# Altium schematic sheet relay_pair_lower.SchDoc
size A4
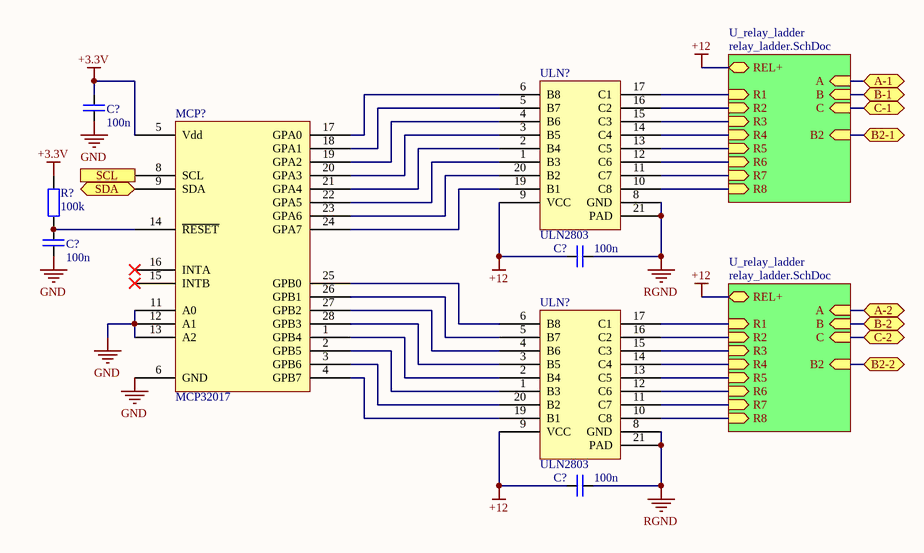
[diagram p0: relay_pair_lower.SchDoc]

## Parts
(Parts that share a designator on the sheet are numbered #1, #2 ... from top to bottom, then left to right.)
C?#1  100n  [R1005_0402i_L]
C?#2  100n  [R1005_0402i_L]
C?#3  100n  [R1005_0402i_L]
C?#4  100n  [R1005_0402i_L]
MCP?  MCP32017  [MCP23017 QFN]
R?  100k  [R1005_0402i_L]
ULN?#1  ULN2803  [QFN127P600-8N]
ULN?#2  ULN2803  [QFN127P600-8N]

## Sub-sheets
U_relay_ladder = relay_ladder.SchDoc: B (in), C (in), A (in), REL+ (bidir), R1 (in), R2 (in), R3 (in), R4 (in), R5 (in), R6 (in), R7 (in), R8 (in), B2 (in)
U_relay_ladder = relay_ladder.SchDoc: B (in), C (in), A (in), REL+ (bidir), R1 (in), R2 (in), R3 (in), R4 (in), R5 (in), R6 (in), R7 (in), R8 (in), B2 (in)

## Ports
A-1 (bidir), A-2 (bidir), B2-1 (bidir), B2-2 (bidir), B-1 (bidir), B-2 (bidir), C-1 (bidir), C-2 (bidir), SCL (in), SDA (bidir)

## Nets
+3.3V: C?#1.2 MCP?.5(Vdd) R?.1
+12: C?#3.1 C?#4.1 ULN?#1.9(VCC) ULN?#2.9(VCC) ; sheet U_relay_ladder/REL+, sheet U_relay_ladder/REL+
GND: C?#1.1 C?#2.1 MCP?.6(GND) MCP?.11(A0) MCP?.12(A1) MCP?.13(A2)
RGND: C?#3.2 C?#4.2 ULN?#1.8(GND) ULN?#1.21(PAD) ULN?#2.8(GND) ULN?#2.21(PAD)
A-1: port A-1, sheet U_relay_ladder/A
A-2: port A-2, sheet U_relay_ladder/A
B2-1: port B2-1, sheet U_relay_ladder/B2
B2-2: port B2-2, sheet U_relay_ladder/B2
B-1: port B-1, sheet U_relay_ladder/B
B-2: port B-2, sheet U_relay_ladder/B
C-1: port C-1, sheet U_relay_ladder/C
C-2: port C-2, sheet U_relay_ladder/C
SCL: MCP?.8(SCL) ; port SCL
SDA: MCP?.9(SDA) ; port SDA
NetC?#2_2: C?#2.2 MCP?.14(~{RESET}) R?.2
NetMCP?_1: MCP?.1(GPB4) ULN?#2.2(B4)
NetMCP?_2: MCP?.2(GPB5) ULN?#2.1(B3)
NetMCP?_3: MCP?.3(GPB6) ULN?#2.20(B2)
NetMCP?_4: MCP?.4(GPB7) ULN?#2.19(B1)
NetMCP?_17: MCP?.17(GPA0) ULN?#1.6(B8)
NetMCP?_18: MCP?.18(GPA1) ULN?#1.5(B7)
NetMCP?_19: MCP?.19(GPA2) ULN?#1.4(B6)
NetMCP?_20: MCP?.20(GPA3) ULN?#1.3(B5)
NetMCP?_21: MCP?.21(GPA4) ULN?#1.2(B4)
NetMCP?_22: MCP?.22(GPA5) ULN?#1.1(B3)
NetMCP?_23: MCP?.23(GPA6) ULN?#1.20(B2)
NetMCP?_24: MCP?.24(GPA7) ULN?#1.19(B1)
NetMCP?_25: MCP?.25(GPB0) ULN?#2.6(B8)
NetMCP?_26: MCP?.26(GPB1) ULN?#2.5(B7)
NetMCP?_27: MCP?.27(GPB2) ULN?#2.4(B6)
NetMCP?_28: MCP?.28(GPB3) ULN?#2.3(B5)
NetULN?#1_10: ULN?#1.10(C8) ; sheet U_relay_ladder/R8
NetULN?#1_11: ULN?#1.11(C7) ; sheet U_relay_ladder/R7
NetULN?#1_12: ULN?#1.12(C6) ; sheet U_relay_ladder/R6
NetULN?#1_13: ULN?#1.13(C5) ; sheet U_relay_ladder/R5
NetULN?#1_14: ULN?#1.14(C4) ; sheet U_relay_ladder/R4
NetULN?#1_15: ULN?#1.15(C3) ; sheet U_relay_ladder/R3
NetULN?#1_16: ULN?#1.16(C2) ; sheet U_relay_ladder/R2
NetULN?#1_17: ULN?#1.17(C1) ; sheet U_relay_ladder/R1
NetULN?#2_10: ULN?#2.10(C8) ; sheet U_relay_ladder/R8
NetULN?#2_11: ULN?#2.11(C7) ; sheet U_relay_ladder/R7
NetULN?#2_12: ULN?#2.12(C6) ; sheet U_relay_ladder/R6
NetULN?#2_13: ULN?#2.13(C5) ; sheet U_relay_ladder/R5
NetULN?#2_14: ULN?#2.14(C4) ; sheet U_relay_ladder/R4
NetULN?#2_15: ULN?#2.15(C3) ; sheet U_relay_ladder/R3
NetULN?#2_16: ULN?#2.16(C2) ; sheet U_relay_ladder/R2
NetULN?#2_17: ULN?#2.17(C1) ; sheet U_relay_ladder/R1

Not connected (* = marked no-connect by the designer): MCP? 15(INTB)* 16(INTA)*

## Library data of the parts
C?#1-C?#4 = C: Capacitor
R? = R